# EasyEDA Pro project ProPrj_通用工程PCB-Update-V3.1_2025-07-16.epro, schematic [SCH]Driver_Board

## Sheets
1 P1: Board Name: Driver_Board; Create Date: 2025-07-09; Page Name: P1; Project Name: 通用工程PCB-Update-V3.1; Schematic Name: [SCH]Driver_Board; Update Date: 2025-07-14; Company: 嘉立创EDA; Page Size: A3; Version: V1.0
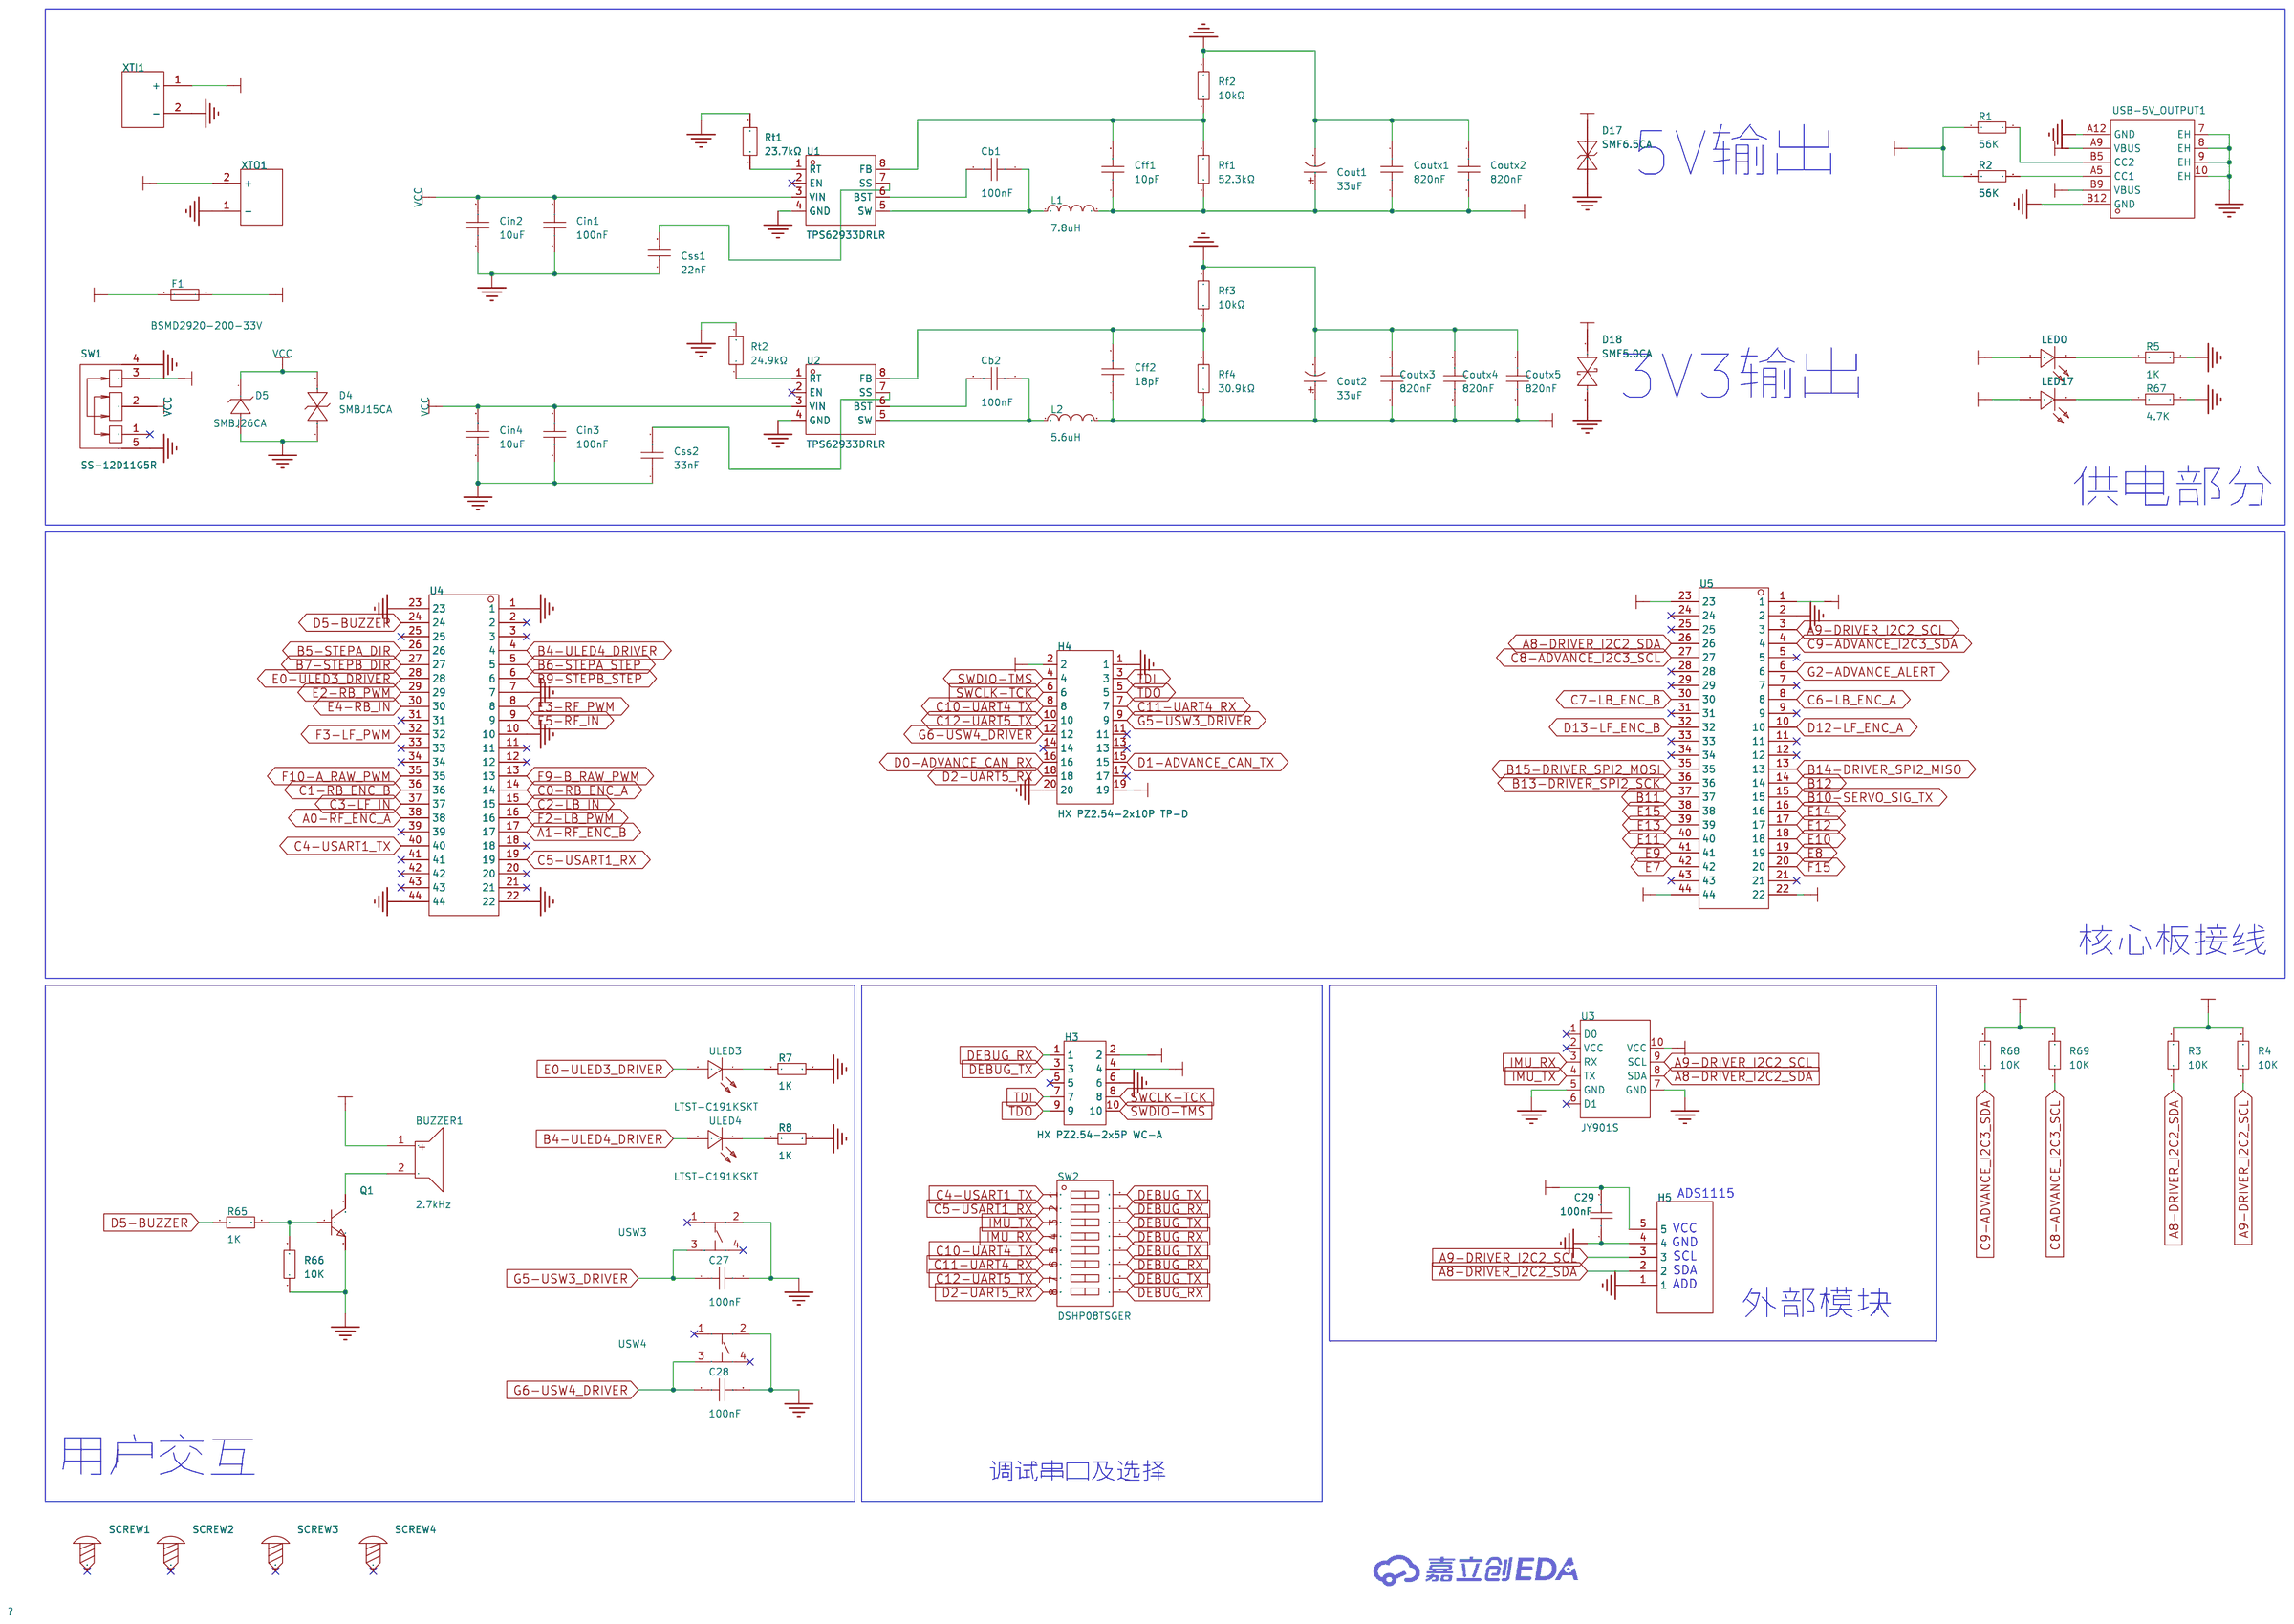
[diagram p4: P1]
2 P2: Page Name: P2; Update Date: 2025-07-09
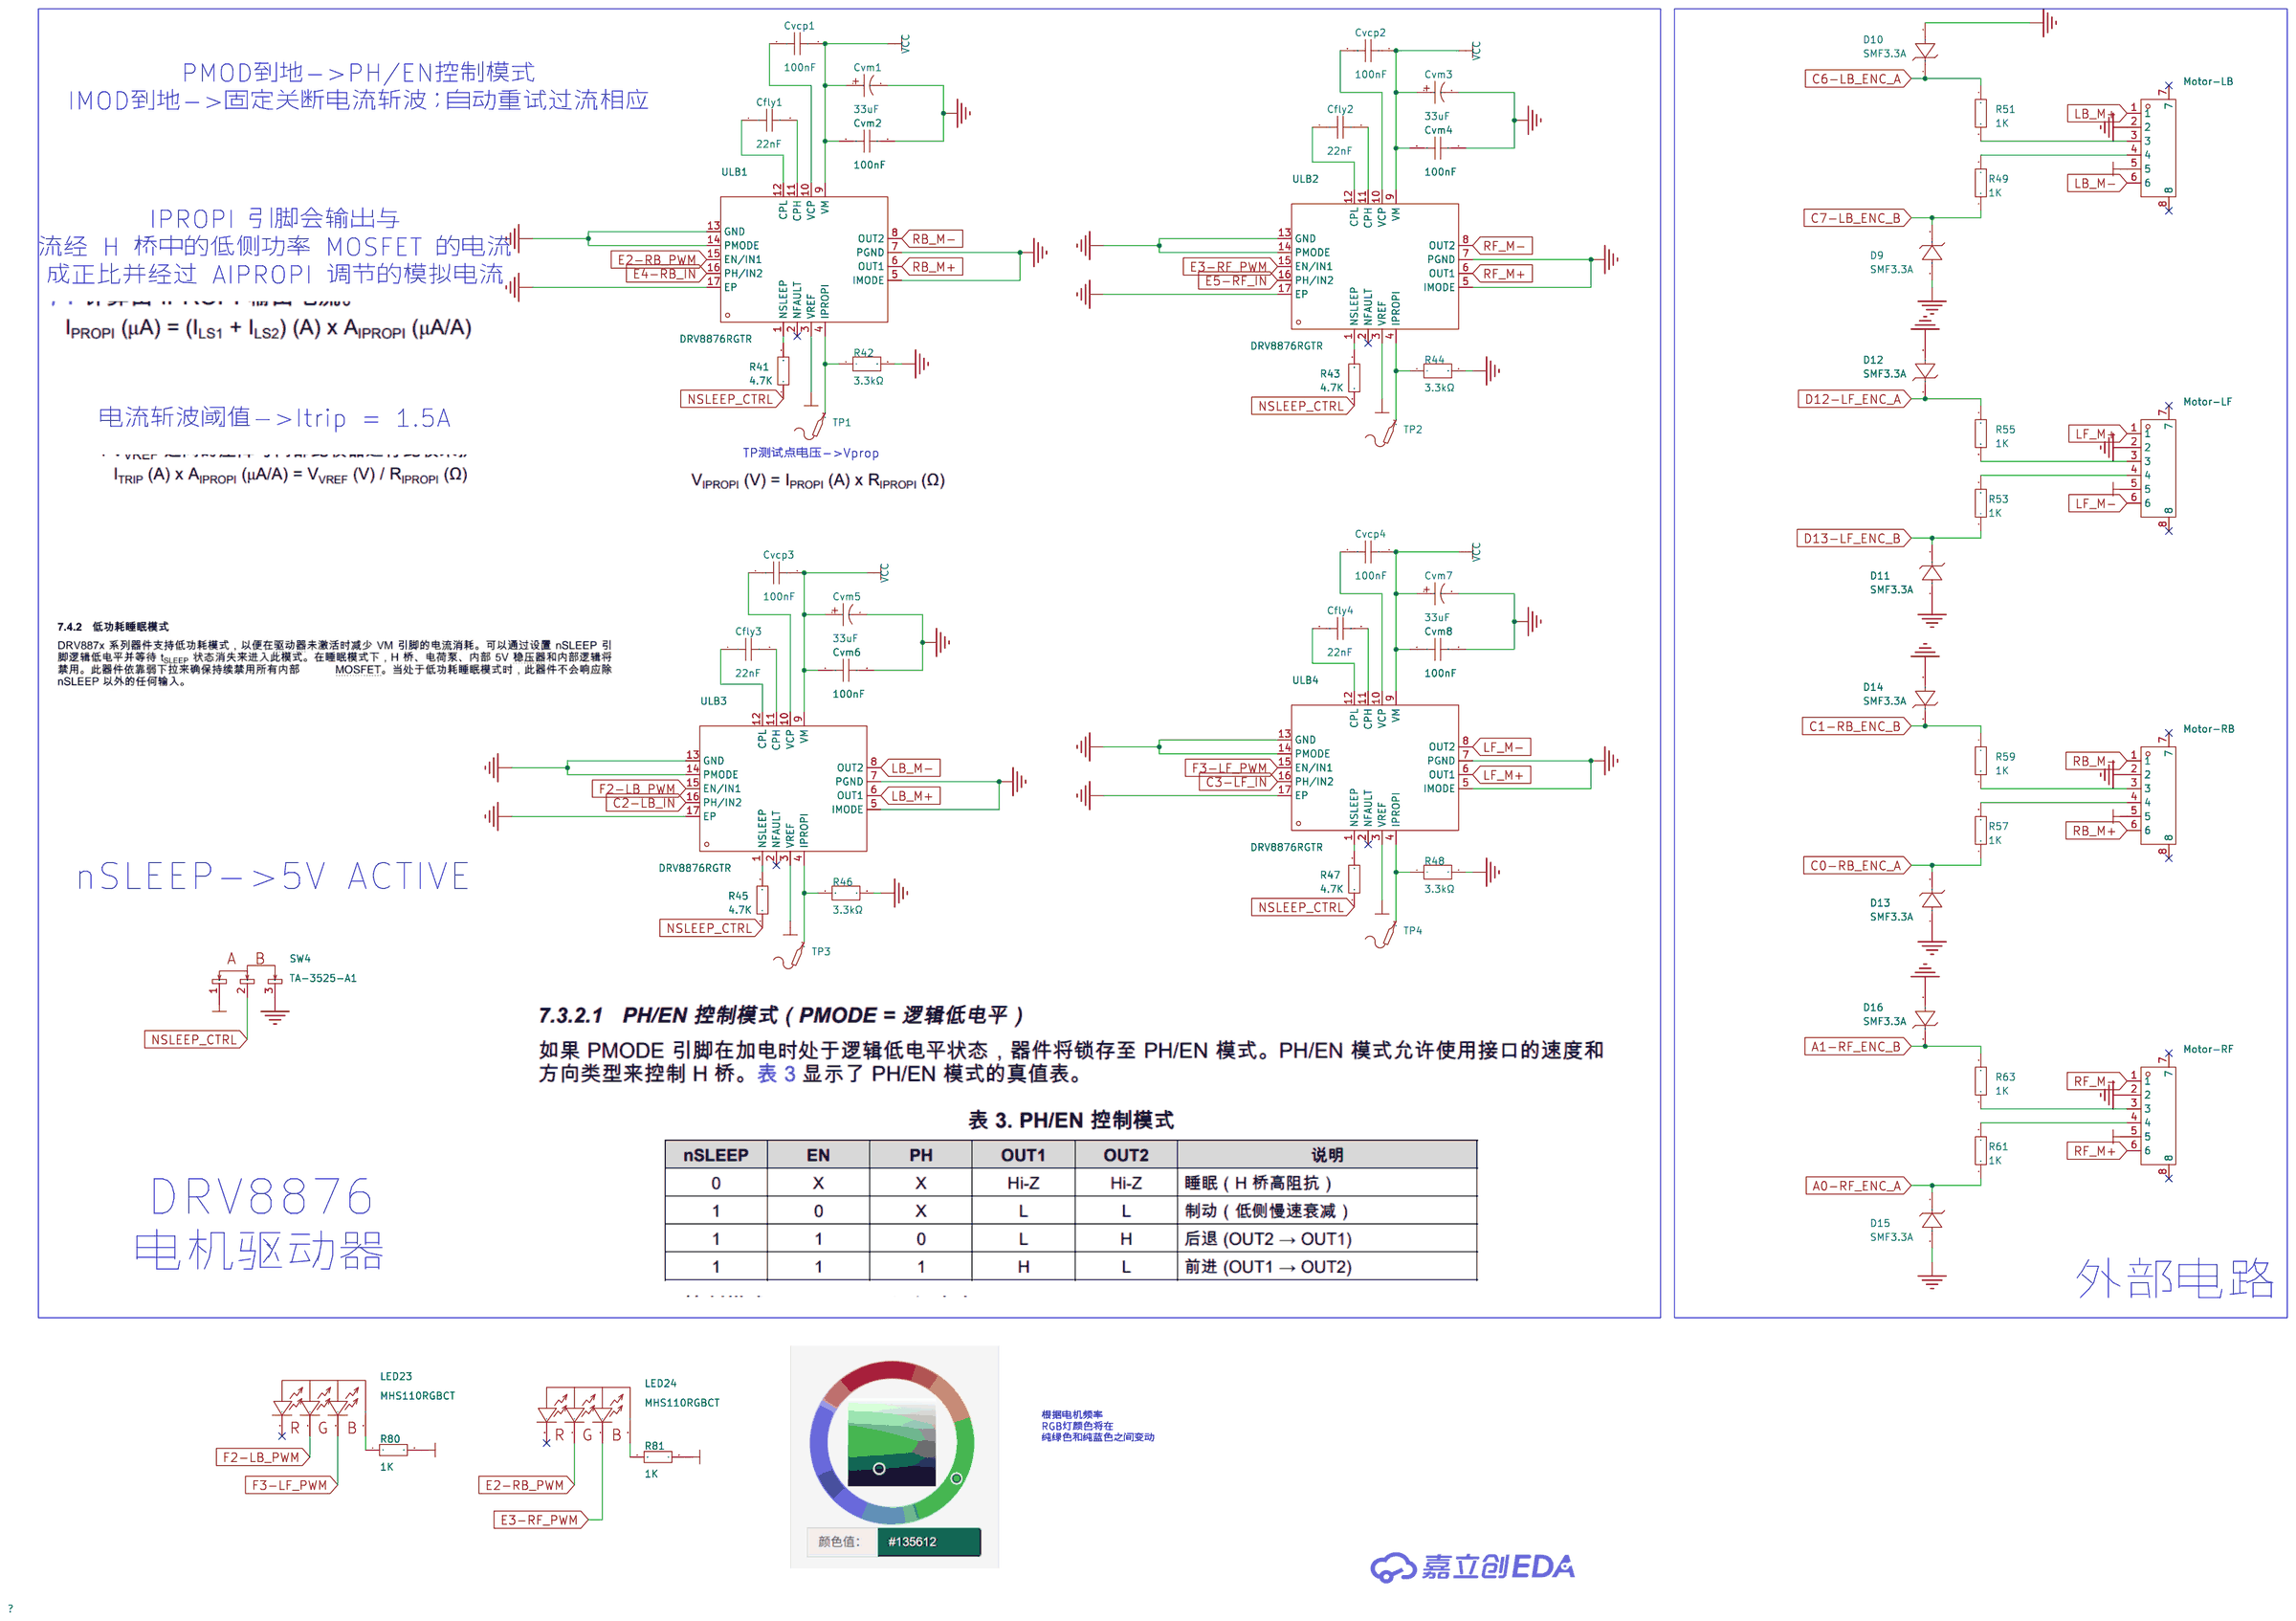
[diagram p5: P2]
3 P3: Page Name: P3; Update Date: 2025-07-09; Page Size: A4
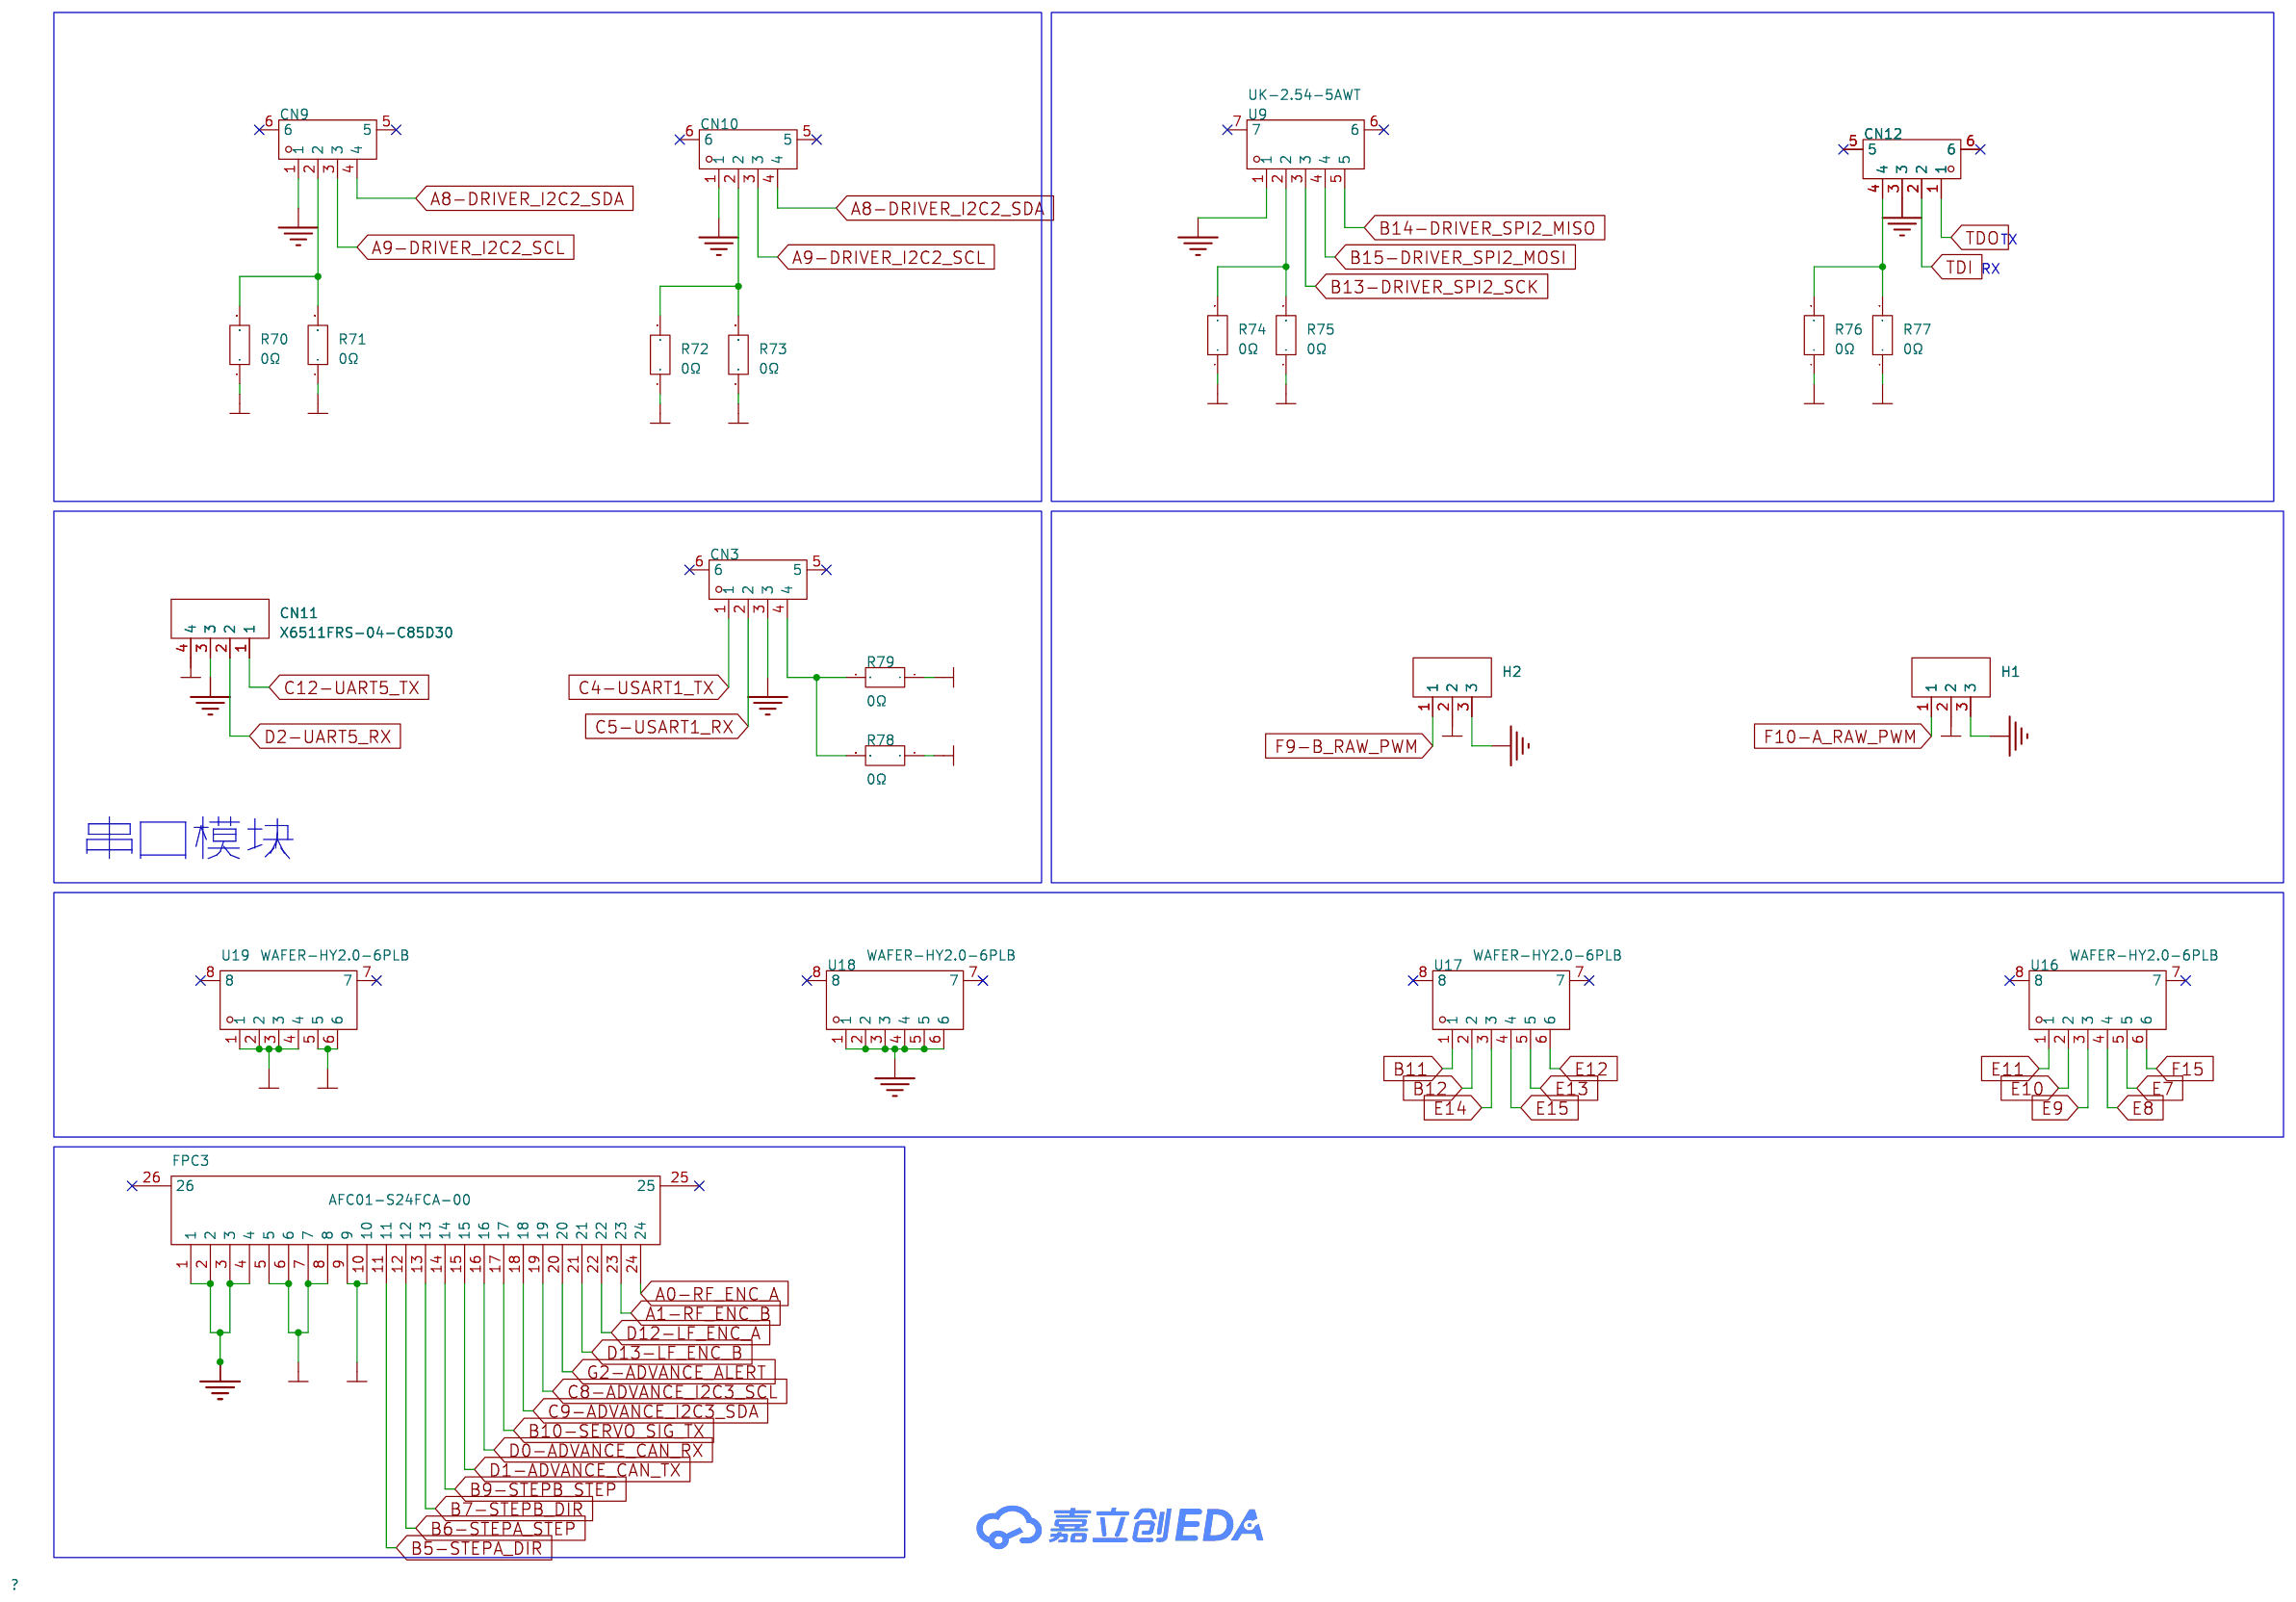
[diagram p6: P3]

## Parts
sheet P1
BUZZER1  2.7kHz  [BUZ-SMD_L9.6-W9.6-LS10.0-R]
C27  100nF  [C0603]
C28  100nF  [C0603]
C29  100nF  [C0603]
Cb1  100nF  [C0402]
Cb2  100nF  [C0402]
Cff1  10pF  [C0402]
Cff2  18pF  [C0402]
Cin1  100nF  [C0603]
Cin2  10uF  [C1206]
Cin3  100nF  [C0603]
Cin4  10uF  [C1206]
Cout1  33uF  [CAP-SMD_BD5.0-L5.3-W5.3-LS6.3-FD]
Cout2  33uF  [CAP-SMD_BD5.0-L5.3-W5.3-LS6.3-FD]
Coutx1  820nF  [C0402]
Coutx2  820nF  [C0402]
Coutx3  820nF  [C0402]
Coutx4  820nF  [C0402]
Coutx5  820nF  [C0402]
Css1  22nF  [C0402]
Css2  33nF  [C0402]
D4  SMBJ15CA  [SMB_L4.6-W3.6-LS5.4-BI]
D5  SMBJ26CA  [SMB_L4.6-W3.6-LS5.4-RD]
D17  SMF6.5CA  [SOD-123FL_L2.7-W1.8-LS3.8-BI]
D18  SMF5.0CA  [SOD-123FL_L2.7-W1.8-LS3.8-BI]
F1  BSMD2920-200-33V  [F2920]
H3  HX PZ2.54-2x5P WC-A  [HDR-TH_10P-P2.54-H-M-R2-C5-S2.54-2]
H4  HX PZ2.54-2x10P TP-D  [HDR-SMD_20P-排母]
H5  -  [卧帖1x5p]
L1  7.8uH  [IND-SMD_L7.3-W6.6]
L2  5.6uH  [IND-SMD_L7.3-W6.6]
LED0  LTST-C191KSKT  [LED0603-RD-YELLOW]
LED17  LTST-C191KSKT  [LED0603-RD-YELLOW]
Q1  -  [S8050_SOT-23]
R1  56K  [R0603]
R2  56K  [R0603]
R3  10K  [R0603]
R4  10K  [R0603]
R5  1K  [R0603]
R7  1K  [R0603]
R8  1K  [R0603]
R65  1K  [R0603]
R66  10K  [R0603]
R67  4.7K  [R0603]
R68  10K  [R0603]
R69  10K  [R0603]
Rf1  52.3kΩ  [R0603]
Rf2  10kΩ  [R0603]
Rf3  10kΩ  [R0603]
Rf4  30.9kΩ  [R0603]
Rt1  23.7kΩ  [R0603]
Rt2  24.9kΩ  [R0603]
SCREW1  -  [M3螺丝]
SCREW2  -  [M3螺丝]
SCREW3  -  [M3螺丝]
SCREW4  -  [M3螺丝]
SW1  SS-12D11G5R  [SW-TH_SS-12D11G5R]
SW2  DSHP08TSGER  [SW-SMD_16P-L11.7-W5.4-P1.27-LS8.5]
U1  TPS62933DRLR  [SOT-583-8_L2.1-W1.2-P0.50-LS1.6-BR]
U2  TPS62933DRLR  [SOT-583-8_L2.1-W1.2-P0.50-LS1.6-BR]
U3  JY901S  [DRIVERUSING_SMD_JY901S]
U4  -  [贴片排母-定位柱 2x22p]
U5  -  [贴片排母-定位柱 2x22p]
ULED3  LTST-C191KSKT  [LED0603-RD-YELLOW]
ULED4  LTST-C191KSKT  [LED0603-RD-YELLOW]
USB-5V_OUTPUT1  -  [USB_ TYPE-C-6P]
USW3  KH-6X6X5H-STM  [SW-SMD_4P-L6.0-W6.0-P4.50-LS9.0_H5.0]
USW4  KH-6X6X5H-STM  [SW-SMD_4P-L6.0-W6.0-P4.50-LS9.0_H5.0]
XTI1  -  [XT60PW]
XTO1  -  [XT60PW]
sheet P2
Cfly1  22nF  [C0805]
Cfly2  22nF  [C0805]
Cfly3  22nF  [C0805]
Cfly4  22nF  [C0805]
Cvcp1  100nF  [C0603]
Cvcp2  100nF  [C0603]
Cvcp3  100nF  [C0603]
Cvcp4  100nF  [C0603]
Cvm1  33uF  [CAP-SMD_BD5.0-L5.3-W5.3-LS6.3-FD]
Cvm2  100nF  [C0603]
Cvm3  33uF  [CAP-SMD_BD5.0-L5.3-W5.3-LS6.3-FD]
Cvm4  100nF  [C0603]
Cvm5  33uF  [CAP-SMD_BD5.0-L5.3-W5.3-LS6.3-FD]
Cvm6  100nF  [C0603]
Cvm7  33uF  [CAP-SMD_BD5.0-L5.3-W5.3-LS6.3-FD]
Cvm8  100nF  [C0603]
D9  SMF3.3A  [SOD-123FL_L2.7-W1.8-LS3.8-RD]
D10  SMF3.3A  [SOD-123FL_L2.7-W1.8-LS3.8-RD]
D11  SMF3.3A  [SOD-123FL_L2.7-W1.8-LS3.8-RD]
D12  SMF3.3A  [SOD-123FL_L2.7-W1.8-LS3.8-RD]
D13  SMF3.3A  [SOD-123FL_L2.7-W1.8-LS3.8-RD]
D14  SMF3.3A  [SOD-123FL_L2.7-W1.8-LS3.8-RD]
D15  SMF3.3A  [SOD-123FL_L2.7-W1.8-LS3.8-RD]
D16  SMF3.3A  [SOD-123FL_L2.7-W1.8-LS3.8-RD]
LED23  MHS110RGBCT  [LED-ARRAY-SMD_MHS110RGBCT]
LED24  MHS110RGBCT  [LED-ARRAY-SMD_MHS110RGBCT]
Motor-LB  ZX-XH2.54-6PWT  [CONN-SMD_ZX-XH2.54-6PWT]
Motor-LF  ZX-XH2.54-6PWT  [CONN-SMD_ZX-XH2.54-6PWT]
Motor-RB  ZX-XH2.54-6PWT  [CONN-SMD_ZX-XH2.54-6PWT]
Motor-RF  ZX-XH2.54-6PWT  [CONN-SMD_ZX-XH2.54-6PWT]
R41  4.7K  [R0402]
R42  3.3kΩ  [R0402]
R43  4.7K  [R0402]
R44  3.3kΩ  [R0402]
R45  4.7K  [R0402]
R46  3.3kΩ  [R0402]
R47  4.7K  [R0402]
R48  3.3kΩ  [R0402]
R49  1K  [R0402]
R51  1K  [R0402]
R53  1K  [R0402]
R55  1K  [R0402]
R57  1K  [R0402]
R59  1K  [R0402]
R61  1K  [R0402]
R63  1K  [R0402]
R80  1K  [R0402]
R81  1K  [R0402]
SW4  TA-3525-A1  [SW-SMD_3P-L9.1-W3.5-P2.50_BDKG-3P-H2MM]
TP1  -  [Test-Point-0.5mm]
TP2  -  [Test-Point-0.5mm]
TP3  -  [Test-Point-0.5mm]
TP4  -  [Test-Point-0.5mm]
ULB1  DRV8876RGTR  [VFQFN-16_L3.0-W3.0-P0.50-BL-EP1.7]
ULB2  DRV8876RGTR  [VFQFN-16_L3.0-W3.0-P0.50-BL-EP1.7]
ULB3  DRV8876RGTR  [VFQFN-16_L3.0-W3.0-P0.50-BL-EP1.7]
ULB4  DRV8876RGTR  [VFQFN-16_L3.0-W3.0-P0.50-BL-EP1.7]
sheet P3
CN3  XDWF-2500-04P  [CONN-SMD_4P-P2.54_MXXH-2.54-04P-WT1-0-A]
CN9  XDWF-2500-04P  [CONN-SMD_4P-P2.54_MXXH-2.54-04P-WT1-0-A]
CN10  XDWF-2500-04P  [CONN-SMD_4P-P2.54_MXXH-2.54-04P-WT1-0-A]
CN11  X6511FRS-04-C85D30  [HDR-SMD_4P-P2.54-H-F]
CN12  XDWF-2500-04P  [CONN-SMD_4P-P2.54_MXXH-2.54-04P-WT1-0-A]
FPC3  AFC01-S24FCA-00  [FPC-SMD_24P-P0.50_AFC01-S24FCA-00]
H1  YZT1070-06104-03025-01  [HDR-TH_3P-P2.54-H-M-W9.7-N]
H2  YZT1070-06104-03025-01  [HDR-TH_3P-P2.54-H-M-W9.7-N]
R70  0Ω  [R1206]
R71  0Ω  [R1206]
R72  0Ω  [R1206]
R73  0Ω  [R1206]
R74  0Ω  [R1206]
R75  0Ω  [R1206]
R76  0Ω  [R1206]
R77  0Ω  [R1206]
R78  0Ω  [R1206]
R79  0Ω  [R1206]
U9  UK-2.54-5AWT  [CONN-SMD_5P-P2.54_USAKRO_UK-2.54-5AWT]
U16  WAFER-HY2.0-6PLB  [CONN-SMD_6P-P2.00_XUNPU_WAFER-HY2.0-6PLB]
U17  WAFER-HY2.0-6PLB  [CONN-SMD_6P-P2.00_XUNPU_WAFER-HY2.0-6PLB]
U18  WAFER-HY2.0-6PLB  [CONN-SMD_6P-P2.00_XUNPU_WAFER-HY2.0-6PLB]
U19  WAFER-HY2.0-6PLB  [CONN-SMD_6P-P2.00_XUNPU_WAFER-HY2.0-6PLB]

## Library data of the parts
BUZZER1 = MLT-9650: 驱动方式:有源(内含驱动线路);构造类型:电磁式;频率:2.7kHz;声压(SPL):85dB;; LCSC Part Name: 耐环保MLT-9650; Supplier Part: C96127; Manufacturer: 华能; JLCPCB Part Class: 扩展库; Datasheet: https://atta.szlcsc.com/upload/public/pdf/source/20170914/C96127_1505374148680969227.pdf; Supplier: LCSC; Driver Circuitry: 有源(内含驱动线路); Technology: 电磁式; Voltage - Supply: 3V~7V; Sound Pressure Level(SPL): 85dB; Length: 9.6mm; Width: 9.6mm; Height: 5.5mm
C27 C28 Cvcp1-Cvcp4 Cvm2 Cvm4 Cvm6 Cvm8 = CC0603KRX7R9BB104: 容值:100nF;精度:±10%;额定电压:50V;温度系数:X7R;; LCSC Part Name: 100nF ±10% 50V; Supplier Part: C14663; Manufacturer: YAGEO(国巨); Supplier Footprint: 0603; JLCPCB Part Class: Basic Part; Datasheet: https://atta.szlcsc.com/upload/public/pdf/source/20180910/C282072_33301C7F631E79921B82A8DAC6BCC5B3.pdf; Supplier: LCSC; Tolerance: ±10%; Voltage Rating: 50V; Temperature Coefficient: X7R
C29 = CAP_0603: Supplier Footprint: 0603
Cb1 Cb2 = CL05B104KB54PNC: 容值:100nF;精度:±10%;额定电压:50V;材质(温度系数):X7R;; LCSC Part Name: 100nF ±10% 50V; Supplier Part: C307331; Manufacturer: SAMSUNG(三星); Supplier Footprint: 0402; JLCPCB Part Class: 基础库; Datasheet: https://atta.szlcsc.com/upload/public/pdf/source/20160218/1457707763339.pdf; Supplier: LCSC; Tolerance: ±10%; Voltage Rated: 50V; Temperature Coefficient: X7R
Cff1 = GJM1555C1H100FB01D: 容值:10pF;精度:±1%;额定电压:50V;材质(温度系数):C0G;; LCSC Part Name: 10pF ±1% 50V; Supplier Part: C782046; Manufacturer: muRata(村田); Supplier Footprint: 0402; JLCPCB Part Class: 扩展库; Datasheet: https://atta.szlcsc.com/upload/public/pdf/source/20200908/C782046_6B495CB8BB5186DFA61FAFE383A0F7E0.pdf; Supplier: LCSC; Tolerance: ±1%; Voltage Rated: 50V; Temperature Coefficient: C0G
Cff2 = GRM1555C1H180FA01D: 容值:18pF;精度:±1%;额定电压:50V;材质(温度系数):C0G;; LCSC Part Name: 18pF ±1% 50V; Supplier Part: C161534; Manufacturer: muRata(村田); Supplier Footprint: 0402; JLCPCB Part Class: 扩展库; Datasheet: https://atta.szlcsc.com/upload/public/pdf/source/20180308/C161534_15204897149751413943.pdf; Supplier: LCSC; Tolerance: ±1%; Voltage Rated: 50V; Temperature Coefficient: C0G
Cin1 Cin3 = CL10B104KB8NNNC: 容值:100nF;精度:±10%;额定电压:50V;材质(温度系数):X7R;; LCSC Part Name: 100nF ±10% 50V; Supplier Part: C1591; Manufacturer: SAMSUNG(三星); Supplier Footprint: 0603; JLCPCB Part Class: 扩展库; Datasheet: https://atta.szlcsc.com/upload/public/pdf/source/20160218/1457707763339.pdf; Supplier: LCSC; Tolerance: ±10%; Voltage Rated: 50V; Temperature Coefficient: X7R
Cin2 Cin4 = CL31B106KBHNNNE: 容值:10uF;精度:±10%;额定电压:50V;材质(温度系数):X7R;; LCSC Part Name: 10uF ±10% 50V; Supplier Part: C89632; Manufacturer: SAMSUNG(三星); Supplier Footprint: 1206; JLCPCB Part Class: 扩展库; Datasheet: https://atta.szlcsc.com/upload/public/pdf/source/20161130/1480498807789.pdf; Supplier: LCSC; Tolerance: ±10%; Voltage Rated: 50V; Temperature Coefficient: X7R
Cout1 Cout2 Cvm1 Cvm3 Cvm5 Cvm7 = RVT1E330M0505_C72507: 容值:33uF;精度:±20%;额定电压:25V;纹波电流:30mA@120Hz;等效串联电阻(ESR):-;; LCSC Part Name: 33uF ±20% 25V; Supplier Part: C72507; Manufacturer: ROQANG(容强); Manufacturer Part: RVT1E330M0505; Supplier Footprint: SMD,D5xL5.4mm; JLCPCB Part Class: 扩展库; Datasheet: https://atta.szlcsc.com/upload/public/pdf/source/20170325/1490427950282.pdf; Supplier: LCSC; Tolerance: ±20%; Voltage Rating: 25V; Ripple Current: 30mA@120Hz; Diameter: 5mm; Height - Seated (Max): 5.4mm; Lifetime: 2000hrs@105℃; Operating Temperature: -40℃~+105℃
Coutx1-Coutx5 = TCC0402X5R824K100AT: 容值:820nF;精度:±10%;额定电压:10V;材质(温度系数):X5R;; LCSC Part Name: 820nF ±10% 10V; Supplier Part: C7393863; Manufacturer: CCTC(三环); Supplier Footprint: 0402; JLCPCB Part Class: 扩展库; Datasheet: https://atta.szlcsc.com/upload/public/pdf/source/20230606/1C21CCC6A1C08E8C3D36DB4723A2CB7D.pdf; Supplier: LCSC; Tolerance: ±10%; Voltage Rated: 10V; Temperature Coefficient: X5R
Css1 = GRM155R71H223KA12D: 容值:22nF;精度:±10%;额定电压:50V;材质(温度系数):X7R;; LCSC Part Name: 22nF ±10% 50V; Supplier Part: C77023; Manufacturer: muRata(村田); Supplier Footprint: 0402; JLCPCB Part Class: 扩展库; Datasheet: https://atta.szlcsc.com/upload/public/pdf/source/20180326/C77023_485AB0D0559A254D360F85D8E7719291.pdf; Supplier: LCSC; Tolerance: ±10%; Voltage Rated: 50V; Temperature Coefficient: X7R
Css2 = GRM155R71H333KE14D: 容值:33nF;精度:±10%;额定电压:50V;材质(温度系数):X7R;; LCSC Part Name: 33nF ±10% 50V; Supplier Part: C415530; Manufacturer: muRata(村田); Supplier Footprint: 0402; JLCPCB Part Class: 扩展库; Datasheet: https://atta.szlcsc.com/upload/public/pdf/source/20200305/C490387_23319AE8C154DEB24C505E6C82A8106A.pdf; Supplier: LCSC; Tolerance: ±10%; Voltage Rated: 50V; Temperature Coefficient: X7R
D4 = SMBJ15CA_C19077570: 极性:双向;反向截止电压(Vrwm):15V;钳位电压:24.4V;峰值脉冲电流(Ipp):24.59A;峰值脉冲功率(Ppp):600W;击穿电压:18.5V;; Supplier Part: C19077570; Manufacturer: 宏嘉诚; Supplier Footprint: SMB; JLCPCB Part Class: 扩展库; Datasheet: https://atta.szlcsc.com/upload/public/pdf/source/20250107/474F05451FC8AB27D7FA0238914F96F6.pdf; Supplier: LCSC; Polarity: 双向; Reverse Stand-Off Voltage (Vrwm): 15V; Clamping Voltage: 24.4V; Peak Pulse Current (Ipp): 24.59A; Peak Pulse Power Dissipation (Ppp): 600W; Voltage - Breakdown: 18.5V; Reverse Leakage Current (Ir): 5uA; Type: TVS
D5 = SMBJ26CA_C19077581: 极性:双向;反向截止电压(Vrwm):26V;钳位电压:42.1V;峰值脉冲电流(Ipp):14.25A;峰值脉冲功率(Ppp):600W;击穿电压:28.9V;; Supplier Part: C19077581; Manufacturer: 宏嘉诚; Supplier Footprint: SMB; Datasheet: https://atta.szlcsc.com/upload/public/pdf/source/20250107/474F05451FC8AB27D7FA0238914F96F6.pdf; Supplier: LCSC; Polarity: 双向; Reverse Stand-Off Voltage (Vrwm): 26V; Clamping Voltage: 42.1V; Peak Pulse Current (Ipp): 14.25A; Peak Pulse Power Dissipation (Ppp): 600W; Voltage - Breakdown: 28.9V; Reverse Leakage Current (Ir): 5uA; Number of Channels: 单路; Type: TVS
D17 = SMF6.5CA_C19077501: 极性:双向;反向截止电压(Vrwm):6.5V;最大钳位电压:11.2V;峰值脉冲电流(Ipp):17.9A;峰值脉冲功率(Ppp):200W;击穿电压:7.22V;; Supplier Part: C19077501; Manufacturer: 宏迦橙; Supplier Footprint: SOD-123FL; JLCPCB Part Class: 扩展库; Datasheet: https://atta.szlcsc.com/upload/public/pdf/source/20241029/BBF9A11676F655A5C9D4546A153AB943.pdf; Supplier: LCSC; polarity: 双向; Reverse Stand-Off Voltage (Vrwm): 6.5V; Maximum Clamping Voltage: 11.2V; Peak Pulse Current (Ipp): 17.9A; Peak Pulse Power Dissipation (Ppp): 200W; Breakdown Voltage: 7.22V; Reverse Leakage Current (Ir): 1uA; Number of Lines: 单路; Operating Temperature: -55℃~+155℃; Type: TVS
D18 = SMF5.0CA_C19077498: 极性:双向;反向截止电压(Vrwm):5V;最大钳位电压:9.2V;峰值脉冲电流(Ipp):21.7A;峰值脉冲功率(Ppp):200W;击穿电压:6.4V;; Supplier Part: C19077498; Manufacturer: 宏迦橙; Supplier Footprint: SOD-123FL; JLCPCB Part Class: 扩展库; Datasheet: https://atta.szlcsc.com/upload/public/pdf/source/20241029/BBF9A11676F655A5C9D4546A153AB943.pdf; Supplier: LCSC; polarity: 双向; Reverse Stand-Off Voltage (Vrwm): 5V; Maximum Clamping Voltage: 9.2V; Peak Pulse Current (Ipp): 21.7A; Peak Pulse Power Dissipation (Ppp): 200W; Breakdown Voltage: 6.4V; Reverse Leakage Current (Ir): 400uA; Number of Lines: 单路; Operating Temperature: -55℃~+155℃; Type: TVS
F1 = BSMD2920-200-33V: 最大电压:33V;最大电流:40A;保持电流:2A;跳闸电流:4A;; LCSC Part Name: 33V 2A 2920自恢复; Supplier Part: C910843; Manufacturer: BHFUSE(佰宏); Supplier Footprint: 2920; JLCPCB Part Class: 扩展库; Datasheet: https://atta.szlcsc.com/upload/public/pdf/source/20230512/D022CCFE0A7F15633C929F419B252442.pdf; Supplier: LCSC; Operating Voltage (Max): 33V; Current Rating (Max): 40A; Hold Current: 2A; Trip Current: 4A; Power Dissipation: 1.8W; Resistance - Initial (Ri) (Min): 20mΩ; Resistance - Post Trip (R1) (Max): 120mΩ; Maximum Time to Trip: 4.5s; Operating Temperature: -40℃~+85℃
H3 = HX PZ2.54-2x5P WC-A: 插针结构:2x5P;间距:2.54mm;行距:2.54mm;圆针/方针:方针;排数:双排;总PIN位数:10P;额定电流:3A;额定电压:-;配合针长度:6mm;塑高:2.5mm;端接针长度:3mm;触头镀层:金;工作温度:-40℃~+105℃;颜色:黑色;; LCSC Part Name: 2x5P 间距:2.54mm 方针; Supplier Part: C41417353; Manufacturer: hanxia(韩下); Supplier Footprint: 弯插,P=2.54mm; JLCPCB Part Class: 扩展库; Datasheet: https://atta.szlcsc.com/upload/public/pdf/source/20240927/FA437746333A020EBA716900D0F4A5E7.pdf; Supplier: LCSC; Pin Structure: 2x5P; Pitch: 2.54mm; Row Spacing: 2.54mm; Circluar Pins/Square Pins: 方针; Number of Rows: 双排; Number of Pins: 10P; Current Rating: 3A; Length of Mating Pin: 6mm; Insulation Height: 2.5mm; Length of End Connection Pin: 3mm; Contact Plating: 金; Operating Temperature: -40℃~+105℃; Color: 黑色
H4 = HX PZ2.54-2x10P TP-D: 双排贴片带柱子  配套排母HX PM2.54-2x10P系列; LCSC Part Name: 配套排母HX PM2.54-2x10P系列 2.54-2*10P立式贴片公头 带定位柱; Supplier Part: C46061674; Manufacturer: hanxia(韩下); Supplier Footprint: SMD,P=2.54mm; Datasheet: https://atta.szlcsc.com/upload/public/pdf/source/20250227/CD8A4921DA8D0A5116E42F42C120EF99.pdf; Supplier: LCSC
H5 = 卧帖排针5p
L1 L2 = SMMS0630-100M: 电感值:10uH;精度:±20%;额定电流:-;饱和电流(Isat):5.5A;类型:一体成型电感;; LCSC Part Name: 10uH ±20% 5.5A; Supplier Part: C128692; Manufacturer: SXN(顺翔诺); Supplier Footprint: SMD,6.6x7.3mm; JLCPCB Part Class: 扩展库; Datasheet: https://atta.szlcsc.com/upload/public/pdf/source/20210810/BBF24330FB2F5029F637830BA9C42C0D.pdf; Supplier: LCSC; Tolerance: ±20%; Saturation Current (Isat): 5.5A; DC Resistance (DCR): 68mΩ; Type: 一体成型电感
LED0 LED17 ULED3 ULED4 = LTST-C191KSKT: 发光颜色:黄色;正向电压(VF):2.1V;功率:75mW;正向电流:20mA;主波长:584.5nm~597nm;二极管配置:-;透镜颜色:无色透明透镜;色温:-;发光强度:104mcd;发光角度:130°;载带方式:-;工作温度:-55℃~+85℃;; LCSC Part Name: 黄灯; Supplier Part: C125100; Manufacturer: LITEON(光宝); Supplier Footprint: 0603; JLCPCB Part Class: 扩展库; Datasheet: https://atta.szlcsc.com/upload/public/pdf/source/20180129/C125100_15171877314981315871.pdf; Supplier: LCSC; Emitted Color: 黄色; Forward Voltage (VF): 2.1V; Power Dissipation: 75mW; Forward Current: 20mA; Dominant Wavelength: 584.5nm~597nm; Peak Wavelength: 588nm; Lens Color: 无色透明透镜; Luminous Intensity: 104mcd; Viewing Angle: 130°; Operating Temperature: -55℃~+85℃
Q1 = S8050_SOT_NPN: Supplier Footprint: SOT-23
R1-R5 R7 R8 R65-R69 = Res_0603: Supplier Footprint: 0603
Rf1 Rf4 = 0603WAF5232T5E: 电阻类型:厚膜电阻;阻值:52.3kΩ;精度:±1%;功率:100mW;最大工作电压:75V;温度系数:±100ppm/℃;; LCSC Part Name: 52.3kΩ ±1% 100mW 厚膜电阻; Supplier Part: C23198; Manufacturer: UNI-ROYAL(厚声); Supplier Footprint: 0603; JLCPCB Part Class: 扩展库; Datasheet: https://atta.szlcsc.com/upload/public/pdf/source/20200306/C422600_1E6D84923E4A46A82E41ADD87F860B5C.pdf; Supplier: LCSC; Type: 厚膜电阻; Tolerance: ±1%; Power(Watts): 100mW; Overload Voltage (Max): 75V; Temperature Coefficient: ±100ppm/℃; Operating Temperature Range: -55℃~+155℃
Rf2 Rf3 = 0603WAF1002T5E: 电阻类型:厚膜电阻;阻值:10kΩ;精度:±1%;功率:100mW;工作电压:75V;温度系数:±100ppm/℃;; LCSC Part Name: 厚膜电阻 10kΩ ±1% 100mW; Supplier Part: C25804; Manufacturer: UNI-ROYAL(厚声); Supplier Footprint: 0603; JLCPCB Part Class: 基础库; Datasheet: https://atta.szlcsc.com/upload/public/pdf/source/20200306/C422600_1E6D84923E4A46A82E41ADD87F860B5C.pdf; Supplier: LCSC; Type: 厚膜电阻; Tolerance: ±1%; Power(Watts): 100mW; Voltage-Supply(Max): 75V; Temperature Coefficient: ±100ppm/℃; Operating Temperature: -55℃~+155℃
Rt1 Rt2 = FRC0603F2372TS: 电阻类型:厚膜电阻;阻值:23.7kΩ;精度:±1%;功率:100mW;工作电压:75V;温度系数:±100ppm/℃;; LCSC Part Name: 23.7kΩ ±1% 100mW 厚膜电阻; Supplier Part: C2933175; Manufacturer: FOJAN(富捷); Supplier Footprint: 0603; JLCPCB Part Class: 扩展库; Datasheet: https://atta.szlcsc.com/upload/public/pdf/source/20211221/925EC7D7225764EE0046F22065062C87.pdf; Supplier: LCSC; Type: 厚膜电阻; Tolerance: ±1%; Power(Watts): 100mW; Voltage-Supply(Max): 75V; Temperature Coefficient: ±100ppm/℃; Operating Temperature: -55℃~+155℃
SCREW1-SCREW4 = M3螺丝: Supplier Footprint: 插件
SW1 = SS-12D11G5R: 电路结构:单刀双掷;安装方式:弯插;开关颜色:黑色;额定电流(DC):5A;额定电压(DC):125V;额定电流(AC):5A;额定电压(AC):125V;机械寿命:1万次;; LCSC Part Name: 柄长5mm 弯插双档 滑动开关; Supplier Part: C388633; Manufacturer: XKB Connectivity(中国星坤); Supplier Footprint: 插件; JLCPCB Part Class: 扩展库; Datasheet: https://atta.szlcsc.com/upload/public/pdf/source/20211009/84F89DEF741E27E9E55DE4039DC07CAD.pdf; Supplier: LCSC; Circuit: 单刀双掷; Actuator Style: 矩形柱状; Pin Style: PC引脚; Switch Length: 13.5mm; Switch Width: 6.6mm; Switch Height: 6.3mm; Mounting Style: 弯插; Actuator Color: 黑色; Current Rating (DC): 5A; Voltage Rating (DC): 125V; Current Rating (AC): 5A; Voltage Rating (AC): 125V; Mechanical Life: 1万次; Operating Temperature: -40℃~+85℃
SW2 = DSHP08TSGER: 电路结构:单刀单掷;开关位数:8位;额定电流:25mA;额定电压:24V;使用寿命:3千次;颜色:黑色;; LCSC Part Name: 8位 1.27mm脚距贴片型 KE拨码开关 拨动开关; Supplier Part: C3293147; Manufacturer: 康深; Supplier Footprint: SMD-16P,5.4x11.7mm; JLCPCB Part Class: 扩展库; Datasheet: https://atta.szlcsc.com/upload/public/pdf/source/20220713/22525EA437E8BDBA6DC20D0B6C422A83.pdf; Supplier: LCSC; Circuit: 单刀单掷; Number of Positions: 8位; Lead Pitch: 1.27mm; Current Rating: 25mA; Voltage Rating: 24V; Operating Temperature: -30℃~+85℃; Operating Life: 3千次; Color: 黑色
U1 U2 = TPS62933DRLR: 功能类型:降压型;输出类型:可调;输入电压:3.8V~30V;输出电压:800mV~22V;输出电流:3A;; Supplier Part: C3200405; Manufacturer: TI(德州仪器); Supplier Footprint: SOT-583; JLCPCB Part Class: 扩展库; Datasheet: https://www.ti.com/cn/lit/gpn/tps62933f; Supplier: LCSC; Function: 降压型; Output Type: 可调; Input Voltage: 3.8V~30V; Output Voltage: 800mV~22V; Output Current: 3A; Switching Frequency: 2.2MHz; Operating Temperature: -40℃~+150℃@(TJ); Synchronous Rectification: 是; Number of Outputs: 1; Topology: 降压式; Switch tube (built-in/external): 内置
U3 = JY901S_C9900175673: Supplier Part: C9900175673; Supplier Footprint: SMD; JLCPCB Part Class: 扩展库; Supplier: LCSC
U4 U5 = 贴片排针-定位柱 2x22p
USB-5V_OUTPUT1 = USB_ Type-C-6P: Supplier Footprint: SMD
USW3 USW4 = KH-6X6X5H-STM: 电路结构:单刀单掷;按钮形状:圆形按钮;安装方式:立贴;开关长度:6mm;开关宽度:6mm;开关高度:5mm;带支架:不带;触点电流:50mA;额定电压(DC):12V;机械寿命:8万次;; LCSC Part Name: 6*6*5mm 立贴 轻触开关; Supplier Part: C2837531; Manufacturer: kinghelm(金航标); Supplier Footprint: SMD; JLCPCB Part Class: 扩展库; Datasheet: https://atta.szlcsc.com/upload/public/pdf/source/20210608/C2837531_45E87AB996CE723B09405FF2EA209C4C.pdf; Supplier: LCSC; Circuit: 单刀单掷; Actuator Style: 圆形按钮; Mounting Style: 立贴; Switch Length: 6mm; Switch Width: 6mm; Switch Height: 5mm; Strike Gundam: 不带; Contact Current: 50mA; Voltage Rating (DC): 12V; Actuator/Cap Color: 黑色; Pin Style: 鸥翼型; Mechanical Life: 8万次
XTI1 = XT60PW-M
XTO1 = XT60PW-F
Cfly1-Cfly4 = GRM21B5C1H223JA01L: 容值:22nF;精度:±5%;额定电压:50V;材质(温度系数):C0G;; LCSC Part Name: 22nF ±5% 50V; Supplier Part: C77069; Manufacturer: muRata(村田); Supplier Footprint: 0805; JLCPCB Part Class: 扩展库; Datasheet: https://atta.szlcsc.com/upload/public/pdf/source/20200305/C490387_23319AE8C154DEB24C505E6C82A8106A.pdf; Supplier: LCSC; Tolerance: ±5%; Voltage Rated: 50V; Temperature Coefficient: C0G
D9-D16 = SMF5.0A_C19077497: 极性:单向;反向截止电压(Vrwm):5V;最大钳位电压:7.3V;峰值脉冲电流(Ipp):27.4A;峰值脉冲功率(Ppp):200W;击穿电压:6.4V;; LCSC Part Name: SMF5.0A; Supplier Part: C19077497; Manufacturer: 宏迦橙; Supplier Footprint: SOD-123FL; JLCPCB Part Class: 扩展库; Datasheet: https://atta.szlcsc.com/upload/public/pdf/source/20231129/4813F17DC56F8B344A8D004597B3633C.pdf; Supplier: LCSC; polarity: 单向; Reverse Stand-Off Voltage (Vrwm): 5V; Maximum Clamping Voltage: 7.3V; Peak Pulse Current (Ipp): 27.4A; Peak Pulse Power Dissipation (Ppp): 200W; Breakdown Voltage: 6.4V; Reverse Leakage Current (Ir): 400uA; Number of Lines: 单路; Operating Temperature: -55℃~+155℃; Type: TVS
LED23 LED24 = MHS110RGBCT: 侧贴面尺寸为3x1.5,美华电子LED SMD贴片侧发光，白色雾状胶体，高亮红绿蓝三色光RGB，电压VF，亮度Iv详见规格书，主波长λd，(R)622nm,(G)520-535nm,(B)465-475nm，发光角度:120deg; LCSC Part Name: RGB三色 侧贴; Supplier Part: C389528; Manufacturer: MEIHUA(美华); Supplier Footprint: SMD,1.5x3mm; JLCPCB Part Class: 扩展库; Datasheet: https://atta.szlcsc.com/upload/public/pdf/source/20190530/C389528_18CC971B89683121AF99AD38EE2CA1FC.pdf; Supplier: LCSC
Motor-LB Motor-LF Motor-RB Motor-RF = ZX-XH2.54-6PWT: 插针结构:1x6P;间距:2.5mm;安装方式:卧贴;参考系列:XH;总PIN数:6P;排数:1;每排PIN数:6;行距:-;额定电流:-;触头材质:黄铜;触头镀层:锡;工作温度范围:-;; LCSC Part Name: 1x6P 间距:2.5mm 卧贴 系列:XH; Supplier Part: C7429675; Manufacturer: Megastar(兆星); Supplier Footprint: SMD,P=2.5mm,卧贴; JLCPCB Part Class: 扩展库; Datasheet: https://atta.szlcsc.com/upload/public/pdf/source/20230619/110A9A69E9933788ED324D93F44FB74B.pdf; Supplier: LCSC; Pins Structure: 1x6P; Pitch: 2.5mm; Mounting Type: 卧贴; Reference Series: XH; Number of Pins: 6P; Number of Rows: 1; Number of PINs Per Row: 6; Contact Material: 黄铜; Contact Plating: 锡; Supplementary Features: 辅助焊脚; Color: 米色; Z-Height of the Board: 6.2mm; X-Length of Bottom Edge on Board (Spacing Line): 20mm; Y-Width of Bottom Edge on Board: 10.5mm
R41 R43 R45 R47 R49 R51 R53 R55 R57 R59 R61 R63 R80 R81 = Res_0402: Supplier Footprint: 0402
R42 R44 R46 R48 = FRC0805F3301TS: 电阻类型:厚膜电阻;阻值:3.3kΩ;精度:±1%;功率:125mW;最大工作电压:150V;温度系数:±100ppm/℃;; LCSC Part Name: 3.3kΩ ±1% 125mW 厚膜电阻; Supplier Part: C2907249; Manufacturer: FOJAN(富捷); Supplier Footprint: 0805; JLCPCB Part Class: 扩展库; Datasheet: https://atta.szlcsc.com/upload/public/pdf/source/20211221/925EC7D7225764EE0046F22065062C87.pdf; Supplier: LCSC; Type: 厚膜电阻; Tolerance: ±1%; Power(Watts): 125mW; Overload Voltage (Max): 150V; Temperature Coefficient: ±100ppm/℃; Operating Temperature Range: -55℃~+155℃
SW4 = TA-3525-A1: LCSC Part Name: 滑动开关9.1*3.5*2.0mm贴片侧拨单排三脚二档; Supplier Part: C514018; Manufacturer: Yuandi(元迪); Supplier Footprint: SMD,3.5x9.1mm; JLCPCB Part Class: 扩展库; Datasheet: https://atta.szlcsc.com/upload/public/pdf/source/20200415/C514019_BD29F4555739DB2630A1255040CB70C0.pdf; Supplier: LCSC
TP1-TP4 = Test-Point: Test Point 测试点
ULB1-ULB4 = DRV8876RGTR: DRV8876 具有集成电流检测和电流检测反馈功能的 40V、3.5A H 桥电机驱动器; LCSC Part Name: 3.5A 有刷直流电机驱动芯片 5.5V; Supplier Part: C1852100; Manufacturer: TI(德州仪器); Supplier Footprint: VFQFN-16-EP(3x3); JLCPCB Part Class: 扩展库; Datasheet: https://www.ti.com/cn/lit/gpn/drv8876; Supplier: LCSC; RDS(on): 350mΩ; Peak Current: 3.5A; Operating Temperature: -40℃~+125℃
CN3 CN9 CN10 CN12 = XDWF-2500-04P: 间距:2.54mm;安装方式:卧贴;参考系列:XH;总PIN数:4P;额定电流:4A;工作温度范围:-40℃~+85℃;; LCSC Part Name: 间距:2.54mm 卧贴 系列:XH; Supplier Part: C19723931; Manufacturer: LX(连欣科技); Supplier Footprint: SMD,P=2.5mm,卧贴; JLCPCB Part Class: 扩展库; Datasheet: https://atta.szlcsc.com/upload/public/pdf/source/20231222/6CB0E40CA6FFE63C5D87C69622E580AB.pdf; Supplier: LCSC; Pitch: 2.54mm; Mounting Style: 卧贴; Reference Series: XH; Number of Pins: 4P; Current Rating (Max): 4A; Operating Temperature Range: -40℃~+85℃
CN11 = X6511FRS-04-C85D30: 插孔结构:1x4P;间距:2.54mm;安装方式:卧贴;排数:单排;总孔位数:4P;塑高:8.5mm;; LCSC Part Name: 间距:2.54mm 1x4P 卧贴; Supplier Part: C5142237; Manufacturer: XKB Connection(中国星坤); Supplier Footprint: SMD,P=2.54mm,卧贴; JLCPCB Part Class: 扩展库; Datasheet: https://atta.szlcsc.com/upload/public/pdf/source/20220822/AB9A82E80C220285963E5EFA3BFD32FF.pdf; Supplier: LCSC; Holes Structure: 1x4P; Pitch: 2.54mm; Mounting Type: 卧贴; Number of Rows: 单排; Number of Positions: 4P; Insulation Height: 8.5mm
FPC3 = AFC01-S24FCA-00: 锁定特性:翻盖式;触点类型:下接;触点数量:24P;间距:0.5mm;安装类型:卧贴;; LCSC Part Name: 间距:0.5mm P数:24P 翻盖式 下接; Supplier Part: C262669; Manufacturer: JS(钜硕电子); Supplier Footprint: SMD,P=0.5mm,卧贴; JLCPCB Part Class: 扩展库; Datasheet: https://atta.szlcsc.com/upload/public/pdf/source/20190816/C413942_2A72D1AC756EAE17EEDF756A339D4500.pdf; Supplier: LCSC; Locking Feature: 翻盖式; Contact Type: 下接; Number of Contacts: 24P; Pitch: 0.5mm; Mounting Type: 卧贴; FFC, FCB Thickness: 0.3mm; Height Above Board: 2mm
H1 H2 = YZT1070-06104-03025-01: 间距:2.54mm;总PIN位数:3P;; LCSC Part Name: 间距:2.54mm; Supplier Part: C22368233; Manufacturer: Xinyangze(鑫扬泽); Supplier Footprint: 弯插,P=2.54mm; JLCPCB Part Class: 扩展库; Datasheet: https://atta.szlcsc.com/upload/public/pdf/source/20240328/A6E74077487251D9491BAC2CB907710D.pdf; Supplier: LCSC; Pitch: 2.54mm; Number of Pins: 3P
R70-R79 = RE1206F1R000: 电阻类型:采样电阻;阻值:0Ω;精度:±1%;功率:1W;; LCSC Part Name: 0mΩ 1W 1206 ±1%; Supplier Part: C46961765; Manufacturer: 捷而瑞; Supplier Footprint: 1206; JLCPCB Part Class: 扩展库; Datasheet: https://atta.szlcsc.com/upload/public/pdf/source/20250325/401775B85EF7B3A580BC34DFED100CB2.pdf; Supplier: LCSC; Type: 采样电阻; Tolerance: ±1%; Power(Watts): 1W
U9 = UK-2.54-5AWT: 插针结构:1x5P;间距:2.54mm;安装方式:卧贴;参考系列:XH;总PIN数:5P;排数:1;每排PIN数:5;额定电流:3A;工作温度范围:-25℃~+85℃;; LCSC Part Name: 间距:2.54mm 卧贴 系列:XH; Supplier Part: C2997409; Manufacturer: USAKRO(美韩); Supplier Footprint: SMD,P=2.54mm,卧贴; JLCPCB Part Class: 扩展库; Datasheet: https://atta.szlcsc.com/upload/public/pdf/source/20220419/3FBD0C889A19EE0C5156EF6460A80EEF.pdf; Supplier: LCSC; Pins Structure: 1x5P; Pitch: 2.54mm; Mounting Style: 卧贴; Reference Series: XH; Number of Pins: 5P; Number of Rows: 1; Number of PINs Per Row: 5; Current Rating (Max): 3A; Operating Temperature Range: -25℃~+85℃
U16-U19 = WAFER-HY2.0-6PLB: 插针结构:1x6P;间距:2mm;安装方式:立贴;参考系列:HY;总PIN数:6P;排数:1;每排PIN数:6;行距:-;额定电流:2A;触头材质:黄铜;触头镀层:-;工作温度范围:-25℃~+85℃;; LCSC Part Name: 1x6P 间距:2mm 立贴 系列:HY; Supplier Part: C3029453; Manufacturer: XUNPU(讯普); Supplier Footprint: SMD,P=2mm; JLCPCB Part Class: 扩展库; Datasheet: https://atta.szlcsc.com/upload/public/pdf/source/20220825/AF79ADE3FFFC6F1365AF12A2D80ED0A5.pdf; Supplier: LCSC; Pins Structure: 1x6P; Pitch: 2mm; Mounting Type: 立贴; Reference Series: HY; Number of Pins: 6P; Number of Rows: 1; Number of PINs Per Row: 6; Current Rating: 2A; Contact Material: 黄铜; Operating Temperature: -25℃~+85℃; Voltage Rating: 250V; Plastic Material: LCP; Supplementary Features: 辅助焊脚; Color: 米色; Z-Height of the Board: 8.28mm; X-Length of Bottom Edge on Board (Spacing Line): 16mm; Y-Width of Bottom Edge on Board: 6.1mm

## Nets
3V3: Cff2.1 Cout2.1 Coutx3.2 Coutx4.2 Coutx5.2 D18.1(A) FPC3.9 FPC3.10 H3.4 L2.2 LED0.2(+) R71.1 R73.1 R75.1 R77.1 R79.1 Rf4.1 U19.5 U19.6 ULB1.3(VREF) ULB2.3(VREF) ULB3.3(VREF) ULB4.3(VREF)
5V: BUZZER1.1 C29.2 Cff1.1 CN11.4 Cout1.1 Coutx1.2 Coutx2.2 D17.2 FPC3.5 FPC3.6 FPC3.7 FPC3.8 H1.2 H2.2 H3.2 H4.2 H4.19 H5.5 L1.2 LED17.2(+) Motor-LB.5 Motor-LF.5 Motor-RB.5 Motor-RF.5 R1.1 R2.1 R3.2 R4.2 R68.2 R69.2 R70.1 R72.1 R74.1 R76.1 R78.1 R80.2 R81.2 Rf1.1 SW4.1 U3.10(VCC) U5.1 U5.22 U5.23 U5.44 U19.1 U19.2 U19.3 U19.4 USB-5V_OUTPUT1.A9(VBUS) USB-5V_OUTPUT1.B9(VBUS)
GND: C27.2 C28.2 C29.1 Cin1.1 Cin2.1 Cin3.1 Cin4.1 CN3.3 CN9.1 CN10.1 CN11.3 CN12.3 Cout1.2 Cout2.2 Coutx1.1 Coutx2.1 Coutx3.1 Coutx4.1 Coutx5.1 Css1.1 Css2.1 Cvm1.2 Cvm2.2 Cvm3.2 Cvm4.2 Cvm5.2 Cvm6.2 Cvm7.2 Cvm8.2 D4.1 D5.2(A) D9.2(A) D10.2(A) D11.2(A) D12.2(A) D13.2(A) D14.2(A) D15.2(A) D16.2(A) D17.1 D18.2(K) FPC3.1 FPC3.2 FPC3.3 FPC3.4 H1.3 H2.3 H3.6 H4.1 H4.20 H5.1 H5.4 Motor-LB.2 Motor-LF.2 Motor-RB.2 Motor-RF.2 Q1.2 R5.2 R7.2 R8.2 R42.2 R44.2 R46.2 R48.2 R66.1 R67.2 Rf2.1 Rf3.1 Rt1.2 Rt2.2 SW1.4 SW1.5 SW4.3 U1.4(GND) U2.4(GND) U3.5(GND) U3.7(GND) U4.1 U4.7 U4.10 U4.22 U4.23 U4.44 U5.2 U9.1 U18.1 U18.2 U18.3 U18.4 U18.5 U18.6 ULB1.5(IMODE) ULB1.7(PGND) ULB1.13(GND) ULB1.14(PMODE) ULB1.17(EP) ULB2.5(IMODE) ULB2.7(PGND) ULB2.13(GND) ULB2.14(PMODE) ULB2.17(EP) ULB3.5(IMODE) ULB3.7(PGND) ULB3.13(GND) ULB3.14(PMODE) ULB3.17(EP) ULB4.5(IMODE) ULB4.7(PGND) ULB4.13(GND) ULB4.14(PMODE) ULB4.17(EP) USB-5V_OUTPUT1.7(EH) USB-5V_OUTPUT1.8(EH) USB-5V_OUTPUT1.9(EH) USB-5V_OUTPUT1.10(EH) USB-5V_OUTPUT1.A12(GND) USB-5V_OUTPUT1.B12(GND) USW3.2 USW4.2 XTI1.2(-) XTO1.1(-)
VCC: Cin1.2 Cin2.2 Cin3.2 Cin4.2 Cvcp1.1 Cvcp2.1 Cvcp3.1 Cvcp4.1 Cvm1.1 Cvm2.1 Cvm3.1 Cvm4.1 Cvm5.1 Cvm6.1 Cvm7.1 Cvm8.1 D4.2 D5.1(K) SW1.2 U1.3(VIN) U2.3(VIN) ULB1.9(VM) ULB2.9(VM) ULB3.9(VM) ULB4.9(VM)
A0-RF_ENC_A: D15.1(K) FPC3.24 R61.1 U4.38
A1-RF_ENC_B: D16.1(K) FPC3.23 R63.1 U4.17
A8-DRIVER_I2C2_SDA: CN9.4 CN10.4 H5.2 R3.1 U3.8(SDA) U5.26
A9-DRIVER_I2C2_SCL: CN9.3 CN10.3 H5.3 R4.1 U3.9(SCL) U5.3
B4-ULED4_DRIVER: U4.4 ULED4.2(+)
B5-STEPA_DIR: FPC3.11 U4.26
B6-STEPA_STEP: FPC3.12 U4.5
B7-STEPB_DIR: FPC3.13 U4.27
B9-STEPB_STEP: FPC3.14 U4.6
B10-SERVO_SIG_TX: FPC3.17 U5.15
B11: U5.37 U17.1
B12: U5.14 U17.2
B13-DRIVER_SPI2_SCK: U5.36 U9.3
B14-DRIVER_SPI2_MISO: U5.13 U9.5
B15-DRIVER_SPI2_MOSI: U5.35 U9.4
BAT_VCC: F1.1 XTI1.1(+) XTO1.2(+)
C0-RB_ENC_A: D13.1(K) R57.1 U4.14
C1-RB_ENC_B: D14.1(K) R59.1 U4.36
C2-LB_IN: U4.15 ULB3.16(PH/IN2)
C3-LF_IN: U4.37 ULB4.16(PH/IN2)
C4-USART1_TX: CN3.1 SW2.1(PIN1) U4.40
C5-USART1_RX: CN3.2 SW2.2(PIN2) U4.19
C6-LB_ENC_A: D10.1(K) R51.1 U5.8
C7-LB_ENC_B: D9.1(K) R49.1 U5.30
C8-ADVANCE_I2C3_SCL: FPC3.19 R69.1 U5.27
C9-ADVANCE_I2C3_SDA: FPC3.18 R68.1 U5.4
C10-UART4_TX: H4.8 SW2.5(PIN5)
C11-UART4_RX: H4.7 SW2.6(PIN6)
C12-UART5_TX: CN11.1 H4.10 SW2.7(PIN7)
D0-ADVANCE_CAN_RX: FPC3.16 H4.16
D1-ADVANCE_CAN_TX: FPC3.15 H4.15
D2-UART5_RX: CN11.2 H4.18 SW2.8(PIN8)
D5-BUZZER: R65.1 U4.24
D12-LF_ENC_A: D12.1(K) FPC3.22 R55.1 U5.10
D13-LF_ENC_B: D11.1(K) FPC3.21 R53.1 U5.32
DEBUG_RX: H3.1 SW2.10(PIN10) SW2.12(PIN12) SW2.14(PIN14) SW2.16
DEBUG_TX: H3.3 SW2.9(PIN9) SW2.11(PIN11) SW2.13(PIN13) SW2.15
E0-ULED3_DRIVER: U4.28 ULED3.2(+)
E2-RB_PWM: LED24.4(-) U4.29 ULB1.15(EN/IN1)
E3-RF_PWM: LED24.1(-) U4.8 ULB2.15(EN/IN1)
E4-RB_IN: U4.30 ULB1.16(PH/IN2)
E5-RF_IN: U4.9 ULB2.16(PH/IN2)
E7: U5.42 U16.5
E8: U5.19 U16.4
E9: U5.41 U16.3
E10: U5.18 U16.2
E11: U5.40 U16.1
E12: U5.17 U17.6
E13: U5.39 U17.5
E14: U5.16 U17.3
E15: U5.38 U17.4
F2-LB_PWM: LED23.4(-) U4.16 ULB3.15(EN/IN1)
F3-LF_PWM: LED23.1(-) U4.32 ULB4.15(EN/IN1)
F9-B_RAW_PWM: H2.1 U4.13
F10-A_RAW_PWM: H1.1 U4.35
F15: U5.20 U16.6
FUSED_VCC: F1.2 SW1.3
G2-ADVANCE_ALERT: FPC3.20 U5.6
G5-USW3_DRIVER: C27.1 H4.9 USW3.3
G6-USW4_DRIVER: C28.1 H4.12 USW4.3
IMU_RX: SW2.4(PIN4) U3.3(RX)
IMU_TX: SW2.3(PIN3) U3.4(TX)
LB_M+: Motor-LB.1 ULB3.6(OUT1)
LB_M-: Motor-LB.6 ULB3.8(OUT2)
LF_M+: Motor-LF.1 ULB4.6(OUT1)
LF_M-: Motor-LF.6 ULB4.8(OUT2)
NSLEEP_CTRL: R41.1 R43.1 R45.1 R47.1 SW4.2
RB_M+: Motor-RB.6 ULB1.6(OUT1)
RB_M-: Motor-RB.1 ULB1.8(OUT2)
RF_M+: Motor-RF.6 ULB2.6(OUT1)
RF_M-: Motor-RF.1 ULB2.8(OUT2)
SWCLK-TCK: H3.8 H4.6
SWDIO-TMS: H3.10 H4.4
TDI: CN12.2 H3.7 H4.3
TDO: CN12.1 H3.9 H4.5
$1N289: Css1.2 U1.7(SS)
$1N574: Rt1.1 U1.1(RT)
$1N771: Cb1.2 U1.6(BST)
$1N1524: Cb1.1 L1.1 U1.5(SW)
$1N2129: R1.2 USB-5V_OUTPUT1.B5(CC2)
$1N2130: R2.2 USB-5V_OUTPUT1.A5(CC1)
$1N2727: Cb2.1 L2.1 U2.5(SW)
$1N2734: Css2.2 U2.7(SS)
$1N2742: Cb2.2 U2.6(BST)
$1N2747: Rt2.1 U2.1(RT)
$1N7657: BUZZER1.2 Q1.3
$1N7660: Q1.1 R65.2 R66.2
$1N8376: R8.1 ULED4.1(-)
$1N8377: R7.1 ULED3.1(-)
$1N8578: LED0.1(-) R5.1
$1N8581: LED17.1(-) R67.1
$1N20736: Cff1.2 Rf1.2 Rf2.2 U1.8(FB)
$1N20769: Cff2.2 Rf3.2 Rf4.2 U2.8(FB)
$2N2254: Cvcp1.2 ULB1.10(VCP)
$2N2362: Cfly1.2 ULB1.11(CPH)
$2N2366: Cfly1.1 ULB1.12(CPL)
$2N2640: R41.2 ULB1.1(NSLEEP)
$2N2889: R42.1 TP1.1 ULB1.4(IPROPI)
$2N3379: Cvcp2.2 ULB2.10(VCP)
$2N3383: Cfly2.2 ULB2.11(CPH)
$2N3385: Cfly2.1 ULB2.12(CPL)
$2N3407: R43.2 ULB2.1(NSLEEP)
$2N3413: R44.1 TP2.1 ULB2.4(IPROPI)
$2N3839: Cvcp3.2 ULB3.10(VCP)
$2N3843: Cfly3.2 ULB3.11(CPH)
$2N3845: Cfly3.1 ULB3.12(CPL)
$2N3867: R45.2 ULB3.1(NSLEEP)
$2N3873: R46.1 TP3.1 ULB3.4(IPROPI)
$2N4299: Cvcp4.2 ULB4.10(VCP)
$2N4303: Cfly4.2 ULB4.11(CPH)
$2N4305: Cfly4.1 ULB4.12(CPL)
$2N4327: R47.2 ULB4.1(NSLEEP)
$2N4333: R48.1 TP4.1 ULB4.4(IPROPI)
$2N6107: Motor-LF.3 R55.2
$2N6109: Motor-LF.4 R53.2
$2N6358: Motor-RB.3 R59.2
$2N6360: Motor-RB.4 R57.2
$2N6609: Motor-RF.3 R63.2
$2N6611: Motor-RF.4 R61.2
$2N7301: Motor-LB.3 R51.2
$2N7305: Motor-LB.4 R49.2
$2N11560: LED23.2(+) R80.1
$2N11665: LED24.2(+) R81.1
$3N467: CN9.2 R70.2 R71.2
$3N748: CN10.2 R72.2 R73.2
$3N936: R74.2 R75.2 U9.2
$3N1225: CN12.4 R76.2 R77.2
$3N1690: CN3.4 R78.2 R79.2

Not connected (* = marked no-connect by the designer): CN3 5* 6*; CN9 5* 6*; CN10 5* 6*; CN12 5* 6*; FPC3 25* 26*; H3 5*; H4 11* 13* 14* 17*; LED23 3(-)*; LED24 3(-)*; Motor-LB 7* 8*; Motor-LF 7* 8*; Motor-RB 7* 8*; Motor-RF 7* 8*; SCREW1 1*; SCREW2 1*; SCREW3 1*; SCREW4 1*; SW1 1*; U1 2(EN)*; U2 2(EN)*; U3 1(D0)* 2(VCC)* 6(D1)*; U4 2* 3* 11* 12* 18* 20* 21* 25* 31* 33* 34* 39* 41* 42* 43*; U5 5* 7* 9* 11* 12* 21* 24* 25* 28* 29* 31* 33* 34* 43*; U9 6* 7*; U16 7* 8*; U17 7* 8*; U18 7* 8*; U19 7* 8*; ULB1 2(NFAULT)*; ULB2 2(NFAULT)*; ULB3 2(NFAULT)*; ULB4 2(NFAULT)*; USW3 1* 4*; USW4 1* 4*

## Notes on the sheets
sheet 1
- 5V输出
- 3V3输出
- 供电部分
- 核心板接线
- ADS1115
- VCC
- GND
- SCL
- ADD
- SDA
- 外部模块
- 用户交互
- 调试串口及选择
sheet 2
- PMOD到地->PH/EN控制模式
  IMOD到地->固定关断电流斩波；自动重试过流相应
- IPROPI 引脚会输出与
  流经 H 桥中的低侧功率 MOSFET 的电流
  成正比并经过 AIPROPI 调节的模拟电流
- 电流斩波阈值->Itrip = 1.5A
- TP测试点电压->Vprop
- nSLEEP->5V ACTIVE
- DRV8876
  电机驱动器
- 外部电路
- 根据电机频率
  RGB灯颜色将在
  纯绿色和纯蓝色之间变动
sheet 3
- TX
- RX
- 串口模块
